# EAGLE design Controle_16_reles V4 (EAGLE 4.09)
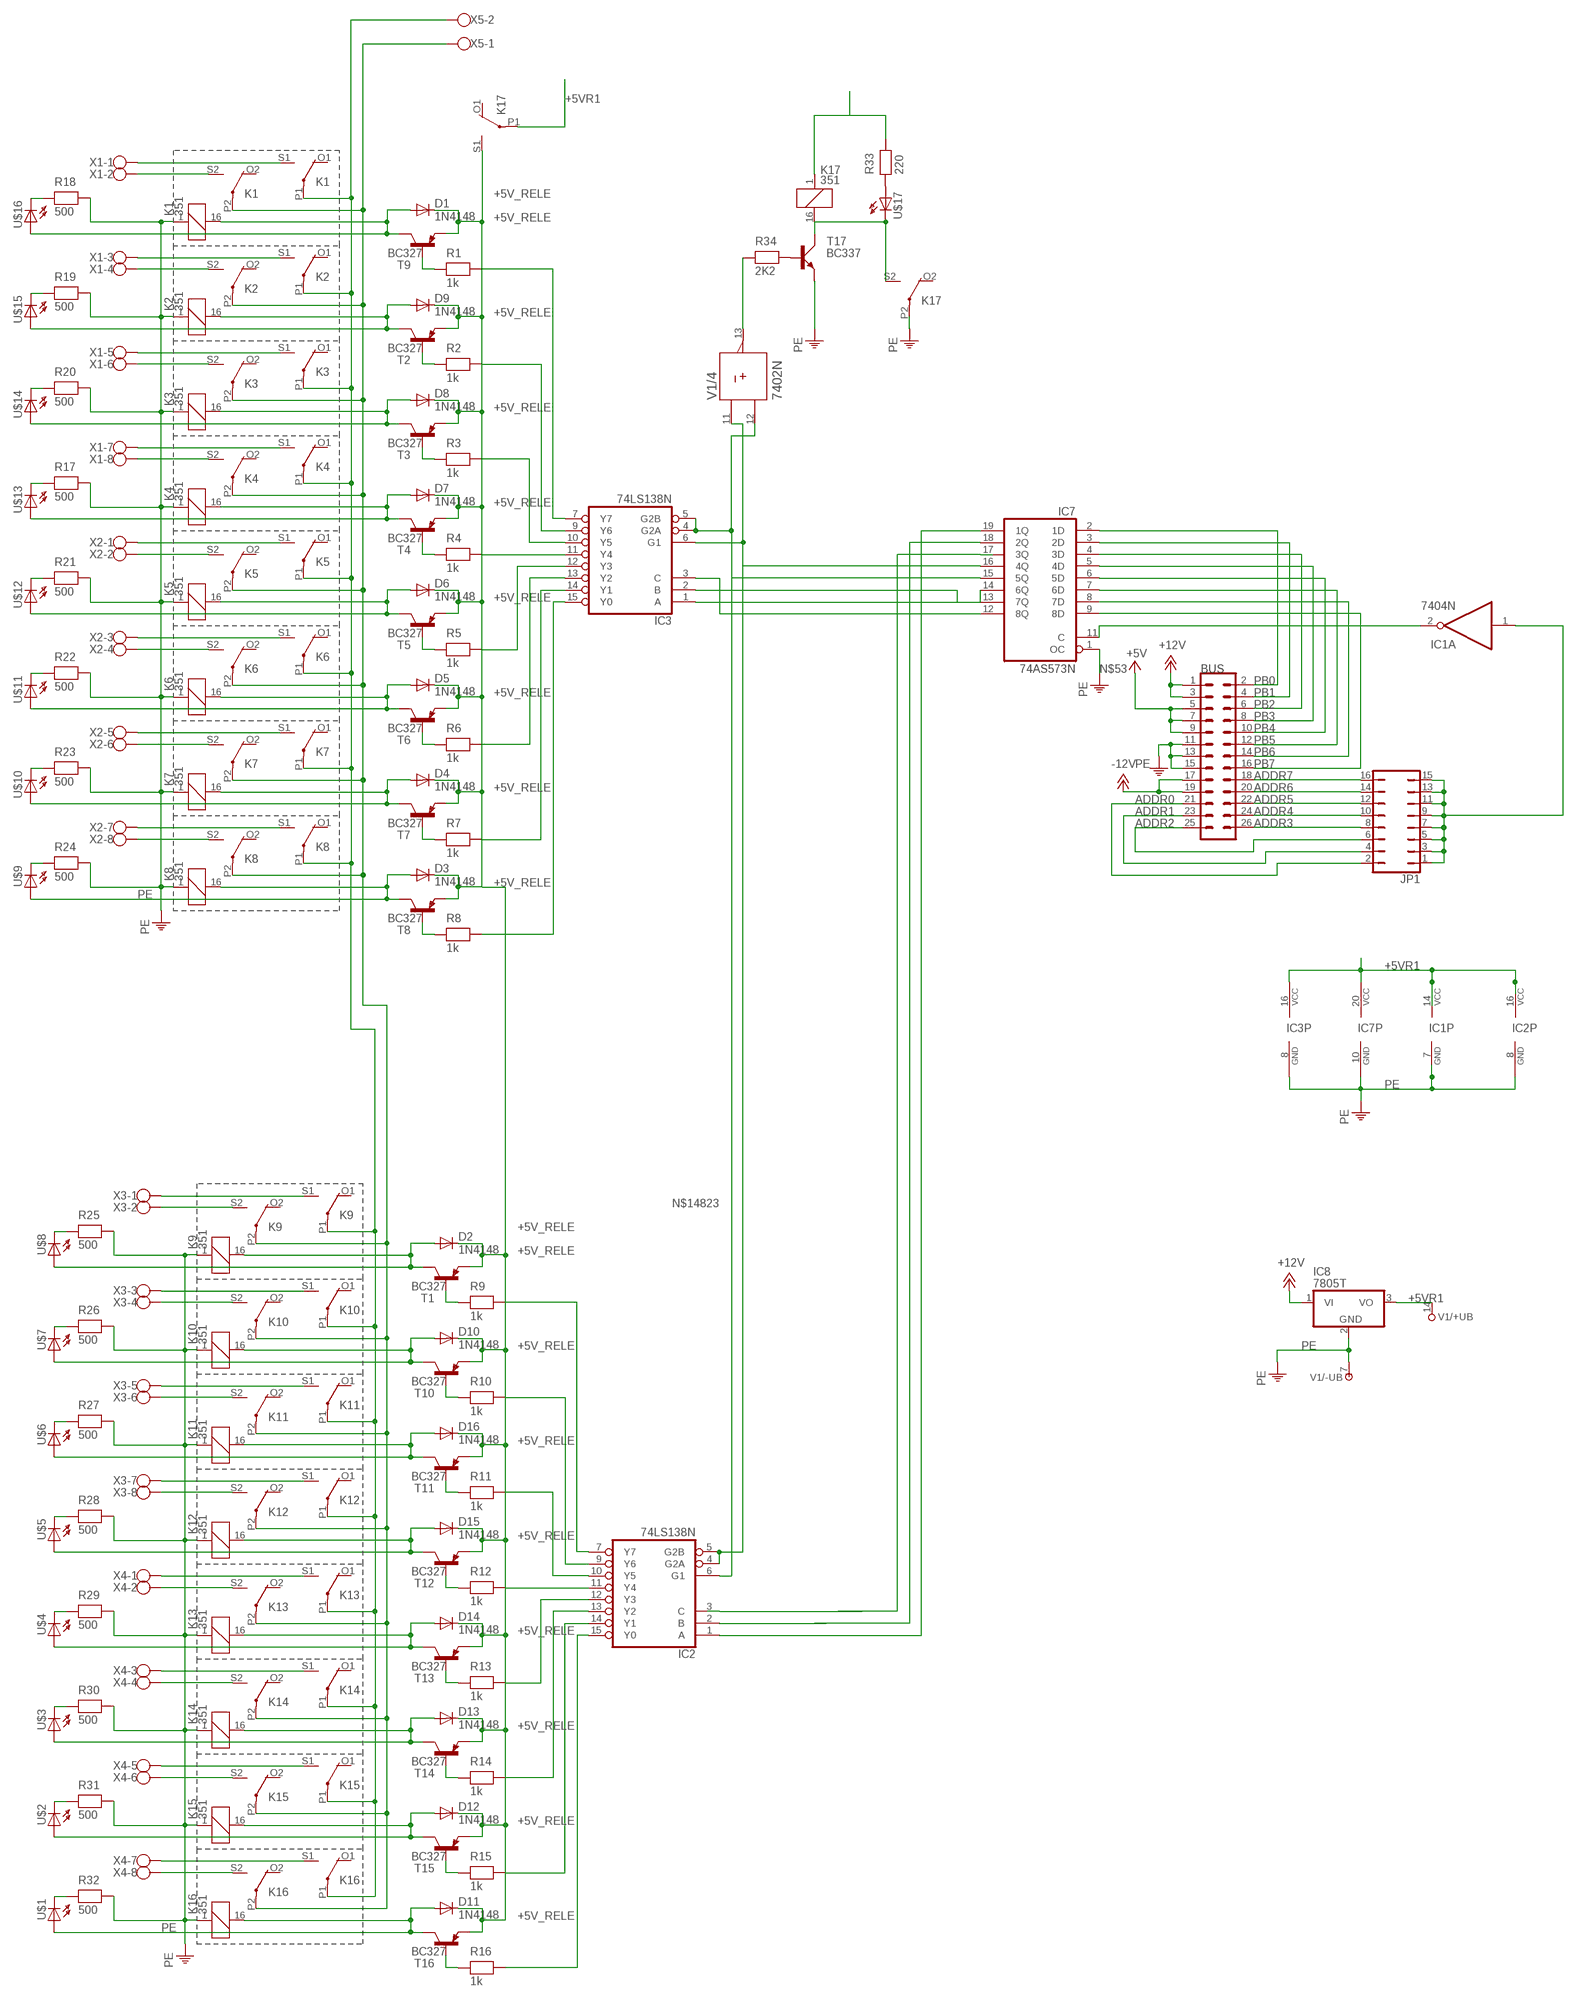
[diagram p0: schematic, sheet 1]

## Parts
BUS  ML26  [ML26]
D1  1N4148  [DO35-10]
D2  1N4148  [DO35-10]
D3  1N4148  [DO35-10]
D4  1N4148  [DO35-10]
D5  1N4148  [DO35-10]
D6  1N4148  [DO35-10]
D7  1N4148  [DO35-10]
D8  1N4148  [DO35-10]
D9  1N4148  [DO35-10]
D10  1N4148  [DO35-10]
D11  1N4148  [DO35-10]
D12  1N4148  [DO35-10]
D13  1N4148  [DO35-10]
D14  1N4148  [DO35-10]
D15  1N4148  [DO35-10]
D16  1N4148  [DO35-10]
IC1  7404N  [DIL14]
IC2  74LS138N  [DIL16]
IC3  74LS138N  [DIL16]
IC7  74AS573N  [DIL20]
IC8  7805T  [TO220H]
JP1  JP8Q  [JP8Q]
K1  351  [351]
K2  351  [351]
K3  351  [351]
K4  351  [351]
K5  351  [351]
K6  351  [351]
K7  351  [351]
K8  351  [351]
K9  351  [351]
K10  351  [351]
K11  351  [351]
K12  351  [351]
K13  351  [351]
K14  351  [351]
K15  351  [351]
K16  351  [351]
K17  351  [351]
R1  1k  RESEU-10  [R-10]
R2  1k  RESEU-10  [R-10]
R3  1k  RESEU-10  [R-10]
R4  1k  RESEU-10  [R-10]
R5  1k  RESEU-10  [R-10]
R6  1k  RESEU-10  [R-10]
R7  1k  RESEU-10  [R-10]
R8  1k  RESEU-10  [R-10]
R9  1k  RESEU-10  [R-10]
R10  1k  RESEU-10  [R-10]
R11  1k  RESEU-10  [R-10]
R12  1k  RESEU-10  [R-10]
R13  1k  RESEU-10  [R-10]
R14  1k  RESEU-10  [R-10]
R15  1k  RESEU-10  [R-10]
R16  1k  RESEU-10  [R-10]
R17  500  RESEU-10  [R-10]
R18  500  RESEU-10  [R-10]
R19  500  RESEU-10  [R-10]
R20  500  RESEU-10  [R-10]
R21  500  RESEU-10  [R-10]
R22  500  RESEU-10  [R-10]
R23  500  RESEU-10  [R-10]
R24  500  RESEU-10  [R-10]
R25  500  RESEU-10  [R-10]
R26  500  RESEU-10  [R-10]
R27  500  RESEU-10  [R-10]
R28  500  RESEU-10  [R-10]
R29  500  RESEU-10  [R-10]
R30  500  RESEU-10  [R-10]
R31  500  RESEU-10  [R-10]
R32  500  RESEU-10  [R-10]
R33  220  RESEU-10  [R-10]
R34  2K2  RESEU-10  [R-10]
T1  BC327  [TO92]
T2  BC327  [TO92]
T3  BC327  [TO92]
T4  BC327  [TO92]
T5  BC327  [TO92]
T6  BC327  [TO92]
T7  BC327  [TO92]
T8  BC327  [TO92]
T9  BC327  [TO92]
T10  BC327  [TO92]
T11  BC327  [TO92]
T12  BC327  [TO92]
T13  BC327  [TO92]
T14  BC327  [TO92]
T15  BC327  [TO92]
T16  BC327  [TO92]
T17  BC337  [SOT54A]
U$1  LED3MM  [LED3MM]
U$2  LED3MM  [LED3MM]
U$3  LED3MM  [LED3MM]
U$4  LED3MM  [LED3MM]
U$5  LED3MM  [LED3MM]
U$6  LED3MM  [LED3MM]
U$7  LED3MM  [LED3MM]
U$8  LED3MM  [LED3MM]
U$9  LED3MM  [LED3MM]
U$10  LED3MM  [LED3MM]
U$11  LED3MM  [LED3MM]
U$12  LED3MM  [LED3MM]
U$13  LED3MM  [LED3MM]
U$14  LED3MM  [LED3MM]
U$15  LED3MM  [LED3MM]
U$16  LED3MM  [LED3MM]
U$17  LED3MM  [LED3MM]
V1  7402N  [DIL14]
X1  AK500/8  [AK500/8]
X2  AK500/8  [AK500/8]
X3  AK500/8  [AK500/8]
X4  AK500/8  [AK500/8]
X5  AK300/2  [AK300/2]

## Nets
+5V: BUS.5 BUS.7 BUS.9
+5V_RELE: D1.C D2.C D3.C D4.C D5.C D6.C D7.C D8.C D9.C D10.C D11.C D12.C D13.C D14.C D15.C D16.C K17.S1(2:S) T1.1(E) T2.1(E) T3.1(E) T4.1(E) T5.1(E) T6.1(E) T7.1(E) T8.1(E) T9.1(E) T10.1(E) T11.1(E) T12.1(E) T13.1(E) T14.1(E) T15.1(E) T16.1(E)
+5VR1: IC1.14(P:VCC) IC2.16(VCC) IC3.16(VCC) IC7.20(VCC) IC8.3(VO) K17.1 K17.P1(2:P) R33.2 V1.14(/+UB:+UB)
+12V: BUS.1 BUS.3 IC8.1(VI)
-12V: BUS.17 BUS.19
ADDR0: BUS.21 JP1.2
ADDR1: BUS.23 JP1.4
ADDR2: BUS.25 JP1.6
ADDR3: BUS.26 JP1.8
ADDR4: BUS.24 JP1.10
ADDR5: BUS.22 JP1.12
ADDR6: BUS.20 JP1.14
ADDR7: BUS.18 JP1.16
GARANTIA1: IC2.6(G1) IC3.4(G2A) IC3.5(G2B) IC7.15(5Q) V1.12(/4:B)
GARANTIA2: IC2.4(G2A) IC2.5(G2B) IC3.6(G1) IC7.16(4Q) V1.11(/4:A)
N$1: R9.1 T1.2(B)
N$2: R5.1 T5.2(B)
N$3: IC3.7(Y7) R1.2
N$4: IC3.9(Y6) R2.2
N$5: IC3.10(Y5) R3.2
N$6: IC3.11(Y4) R4.2
N$7: IC3.15(Y0) R8.2
N$8: IC3.14(Y1) R7.2
N$9: IC3.13(Y2) R6.2
N$10: R1.1 T9.2(B)
N$12: IC2.2(B) IC7.18(2Q)
N$13: R34.2 T17.B
N$15: D6.A K5.16 T5.3(C) U$12.A
N$16: K17.16 K17.S2(3:S) T17.C U$17.K(C)
N$17: R2.1 T2.2(B)
N$18: D1.A K1.16 T9.3(C) U$16.A
N$19: D9.A K2.16 T2.3(C) U$15.A
N$20: R6.1 T6.2(B)
N$21: R3.1 T3.2(B)
N$22: D8.A K3.16 T3.3(C) U$14.A
N$23: D5.A K6.16 T6.3(C) U$11.A
N$24: R4.1 T4.2(B)
N$25: D7.A K4.16 T4.3(C) U$13.A
N$26: R7.1 T7.2(B)
N$27: D4.A K7.16 T7.3(C) U$10.A
N$28: R8.1 T8.2(B)
N$29: D3.A K8.16 T8.3(C) U$9.A
N$30: IC3.12(Y3) R5.2
N$32: R34.1 V1.13(/4:Y)
N$33: IC1.1(A:I) JP1.1 JP1.3 JP1.5 JP1.7 JP1.9 JP1.11 JP1.13 JP1.15
N$34: IC3.1(A) IC7.14(6Q)
N$35: K1.S1(2:S) X1.1
N$36: K1.S2(3:S) X1.2
N$37: K2.S1(2:S) X1.3
N$38: K2.S2(3:S) X1.4
N$39: K3.S1(2:S) X1.5
N$40: K3.S2(3:S) X1.6
N$41: K4.S1(2:S) X1.7
N$42: K4.S2(3:S) X1.8
N$43: K5.S1(2:S) X2.1
N$44: K5.S2(3:S) X2.2
N$45: K6.S1(2:S) X2.3
N$46: K6.S2(3:S) X2.4
N$47: K7.S1(2:S) X2.5
N$48: K7.S2(3:S) X2.6
N$49: K8.S1(2:S) X2.7
N$50: K8.S2(3:S) X2.8
N$51: R18.1 U$16.K(C)
N$52: D2.A K9.16 T1.3(C) U$8.A
N$53: IC1.2(A:O) IC7.11(C)
N$54: R10.1 T10.2(B)
N$55: D10.A K10.16 T10.3(C) U$7.A
N$56: R11.1 T11.2(B)
N$57: D16.A K11.16 T11.3(C) U$6.A
N$58: R12.1 T12.2(B)
N$60: D15.A K12.16 T12.3(C) U$5.A
N$61: R13.1 T13.2(B)
N$62: D14.A K13.16 T13.3(C) U$4.A
N$63: R14.1 T14.2(B)
N$64: D13.A K14.16 T14.3(C) U$3.A
N$65: R15.1 T15.2(B)
N$66: D12.A K15.16 T15.3(C) U$2.A
N$67: R16.1 T16.2(B)
N$68: D11.A K16.16 T16.3(C) U$1.A
N$69: IC2.7(Y7) R9.2
N$70: IC2.9(Y6) R10.2
N$71: IC2.10(Y5) R11.2
N$72: IC2.11(Y4) R12.2
N$73: IC2.15(Y0) R16.2
N$74: IC2.14(Y1) R15.2
N$75: IC2.13(Y2) R14.2
N$76: IC2.12(Y3) R13.2
N$77: IC3.2(B) IC7.13(7Q)
N$78: K9.S1(2:S) X3.1
N$79: K9.S2(3:S) X3.2
N$80: K10.S1(2:S) X3.3
N$81: K10.S2(3:S) X3.4
N$82: K11.S1(2:S) X3.5
N$83: K11.S2(3:S) X3.6
N$84: K12.S1(2:S) X3.7
N$85: K12.S2(3:S) X3.8
N$86: K13.S1(2:S) X4.1
N$87: K13.S2(3:S) X4.2
N$88: K14.S1(2:S) X4.3
N$89: K14.S2(3:S) X4.4
N$90: K15.S1(2:S) X4.5
N$91: K15.S2(3:S) X4.6
N$92: K16.S1(2:S) X4.7
N$93: K16.S2(3:S) X4.8
N$94: R20.1 U$14.K(C)
N$95: R19.1 U$15.K(C)
N$96: R32.1 U$1.K(C)
N$97: IC3.3(C) IC7.12(8Q)
N$98: R17.1 U$13.K(C)
N$112: R33.1 U$17.A
N$114: IC2.3(C) IC7.17(3Q)
N$118: IC2.1(A) IC7.19(1Q)
N$148: K1.P1(2:P) K2.P1(2:P) K3.P1(2:P) K4.P1(2:P) K5.P1(2:P) K6.P1(2:P) K7.P1(2:P) K8.P1(2:P) K9.P1(2:P) K10.P1(2:P) K11.P1(2:P) K12.P1(2:P) K13.P1(2:P) K14.P1(2:P) K15.P1(2:P) K16.P1(2:P) X5.2
N$150: R21.1 U$12.K(C)
N$153: R22.1 U$11.K(C)
N$156: R23.1 U$10.K(C)
N$160: R24.1 U$9.K(C)
N$163: R25.1 U$8.K(C)
N$165: R26.1 U$7.K(C)
N$169: R27.1 U$6.K(C)
N$171: R28.1 U$5.K(C)
N$174: R29.1 U$4.K(C)
N$177: R30.1 U$3.K(C)
N$180: R31.1 U$2.K(C)
N$14823: K1.P2(3:P) K2.P2(3:P) K3.P2(3:P) K4.P2(3:P) K5.P2(3:P) K6.P2(3:P) K7.P2(3:P) K8.P2(3:P) K9.P2(3:P) K10.P2(3:P) K11.P2(3:P) K12.P2(3:P) K13.P2(3:P) K14.P2(3:P) K15.P2(3:P) K16.P2(3:P) X5.1
PB0: BUS.2 IC7.2(1D)
PB1: BUS.4 IC7.3(2D)
PB2: BUS.6 IC7.4(3D)
PB3: BUS.8 IC7.5(4D)
PB4: BUS.10 IC7.6(5D)
PB5: BUS.12 IC7.7(6D)
PB6: BUS.14 IC7.8(7D)
PB7: BUS.16 IC7.9(8D)
PE: BUS.11 BUS.13 BUS.15 IC1.7(P:GND) IC2.8(GND) IC3.8(GND) IC7.1(OC) IC7.10(GND) IC8.2(GND) K1.1 K2.1 K3.1 K4.1 K5.1 K6.1 K7.1 K8.1 K9.1 K10.1 K11.1 K12.1 K13.1 K14.1 K15.1 K16.1 K17.P2(3:P) R17.2 R18.2 R19.2 R20.2 R21.2 R22.2 R23.2 R24.2 R25.2 R26.2 R27.2 R28.2 R29.2 R30.2 R31.2 R32.2 T17.E V1.7(/-UB:-UB)
Unconnected: IC1.3(B:I) IC1.4(B:O) IC1.5(C:I) IC1.6(C:O) IC1.8(D:O) IC1.9(D:I) IC1.10(E:O) IC1.11(E:I) IC1.12(F:O) IC1.13(F:I) K1.O1(2:O) K1.O2(3:O) K2.O1(2:O) K2.O2(3:O) K3.O1(2:O) K3.O2(3:O) K4.O1(2:O) K4.O2(3:O) K5.O1(2:O) K5.O2(3:O) K6.O1(2:O) K6.O2(3:O) K7.O1(2:O) K7.O2(3:O) K8.O1(2:O) K8.O2(3:O) K9.O1(2:O) K9.O2(3:O) K10.O1(2:O) K10.O2(3:O) K11.O1(2:O) K11.O2(3:O) K12.O1(2:O) K12.O2(3:O) K13.O1(2:O) K13.O2(3:O) K14.O1(2:O) K14.O2(3:O) K15.O1(2:O) K15.O2(3:O) K16.O1(2:O) K16.O2(3:O) K17.O1(2:O) K17.O2(3:O) V1.1(/1:Y) V1.2(/1:A) V1.3(/1:B) V1.4(/2:Y) V1.5(/2:A) V1.6(/2:B) V1.8(/3:A) V1.9(/3:B) V1.10(/3:Y)

## Library data of the parts
BUS = con-harting-ml:ML26: HARTING
D1-D16 = diode:1N4148: DIODE high speed (Philips)
IC1 = 74xx-us:74*04: Hex INVERTER
IC2 IC3 = 74xx-us:74*138: 3-line to 8-line DECODER/DEMULTIPLEXER
IC7 = 74xx-us:74*573: 8-bit D latch BUS DRIVER
IC8 = linear:78*: Positive VOLTAGE REGULATOR
JP1 = jumper:JP8Q: JUMPER
K1-K17 = relay:351: RELAY 2 x switch, Omron
R1-R34 = discrete:RESEU-10
T1-T16 = transistor-pnp:BC327: PNP Transistor
T17 = transistor-small-signal:BC337: NPN TRANSISTOR
U$1-U$17 = led:LED: LED
V1 = 74ttl-din:74*02: Quad 2-input NOR gate
X1-X4 = con-ptr500:AK500/8: CONNECTOR
X5 = con-ptr500:AK300/2: CONNECTOR

## Board
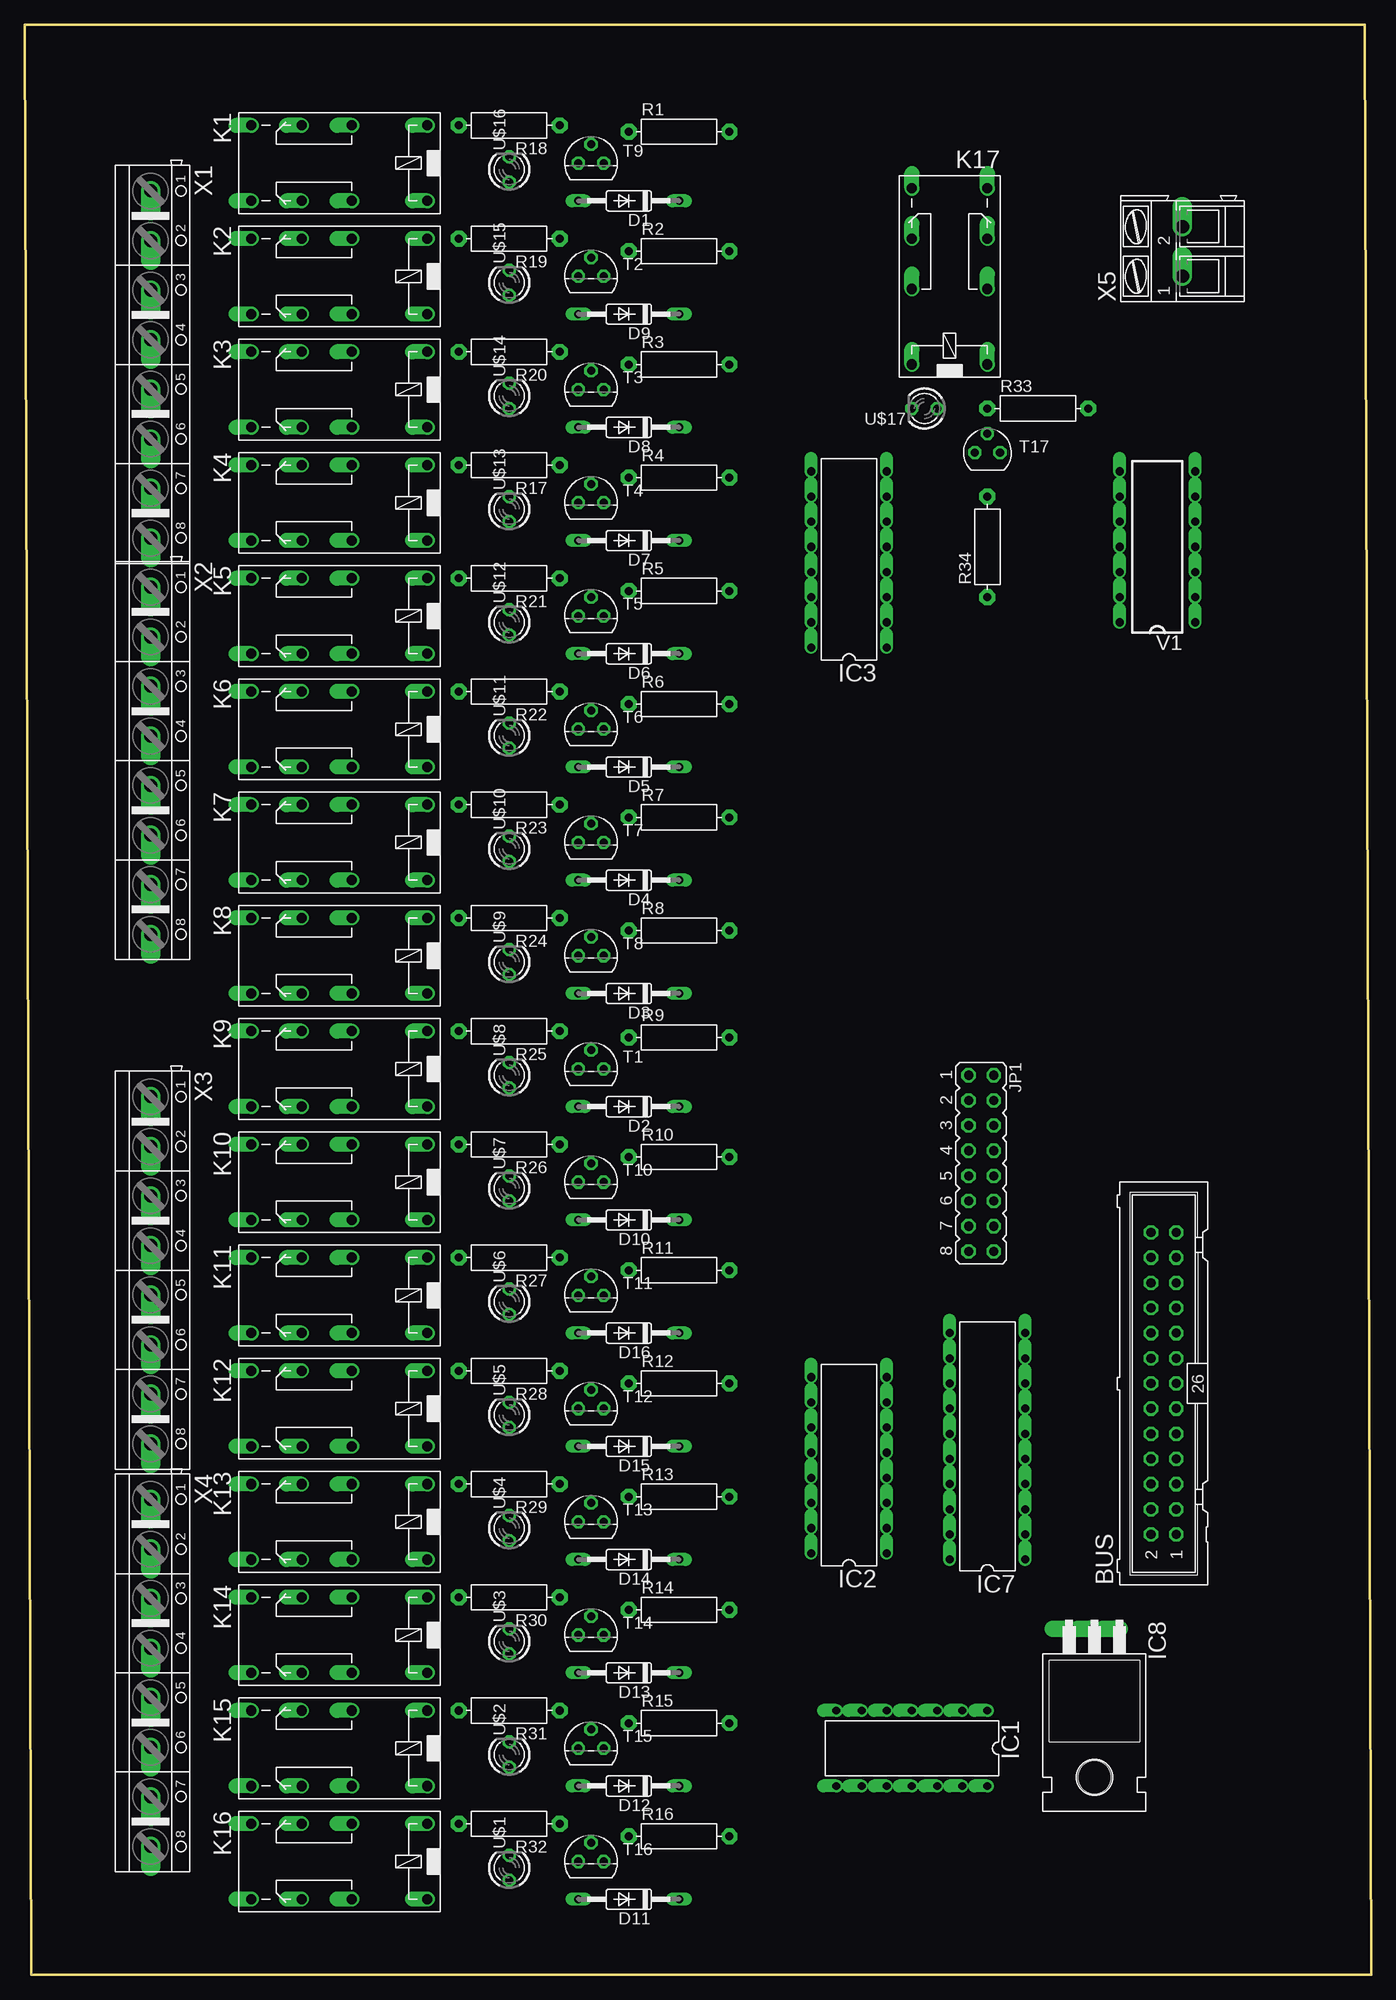
[diagram p1: board, top side]
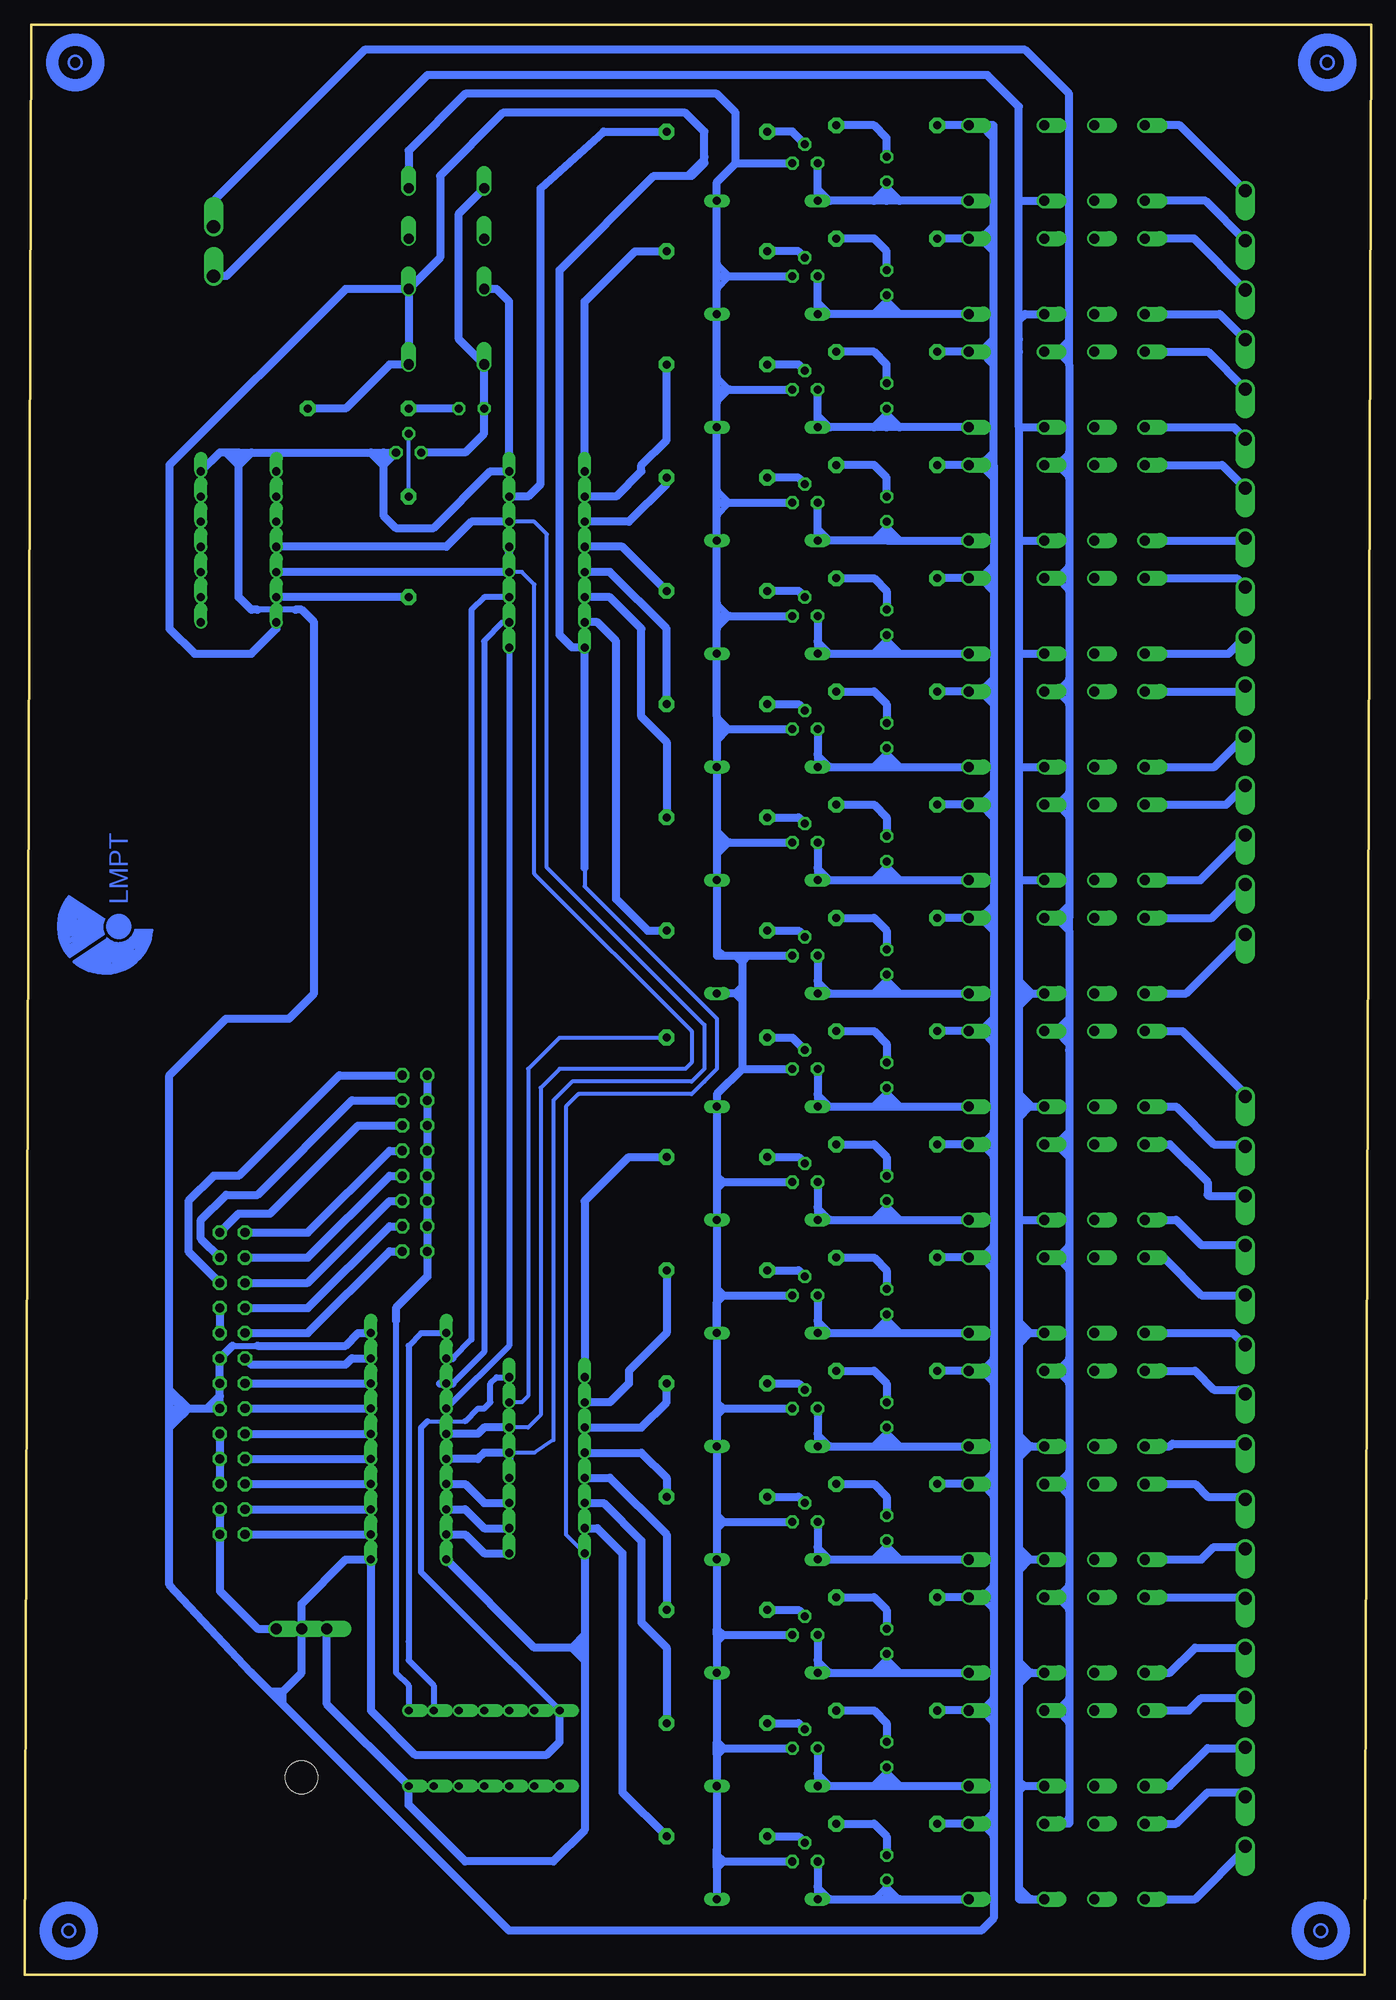
[diagram p2: board, bottom side, seen from below]

Size 135.89 x 196.85 mm. Coordinates in mm from the lower left corner, seen from the top.
Outline: 135.25,196.85 135.89,0 0.64,0 0,196.85 135.25,196.85
Copper layers used: Bottom

### Footprints (pad centres in the part's own frame; a part is rotated, then mirrored left to right if it is on the bottom)
ML26 = drill 0.914 octagon: 1 -15.24,-1.27; 2 -15.24,1.27; 3 -12.7,-1.27; 4 -12.7,1.27; 5 -10.16,-1.27; 6 -10.16,1.27; 7 -7.62,-1.27; 8 -7.62,1.27; 9 -5.08,-1.27; 10 -5.08,1.27; 11 -2.54,-1.27; 12 -2.54,1.27; 13 0,-1.27; 14 0,1.27; 15 2.54,-1.27; 16 2.54,1.27; 17 5.08,-1.27; 18 5.08,1.27; 19 7.62,-1.27; 20 7.62,1.27; 21 10.16,-1.27; 22 10.16,1.27; 23 12.7,-1.27; 24 12.7,1.27; 25 15.24,-1.27; 26 15.24,1.27
DO35-10 = drill 0.813 long: A 5.08,0; C -5.08,0
DIL14 = drill 0.8 offset: 1 -7.62,-3.81; 2 -5.08,-3.81; 3 -2.54,-3.81; 4 0,-3.81; 5 2.54,-3.81; 6 5.08,-3.81; 7 7.62,-3.81; 8 7.62,3.81; 9 5.08,3.81; 10 2.54,3.81; 11 0,3.81; 12 -2.54,3.81; 13 -5.08,3.81; 14 -7.62,3.81
DIL16 = drill 0.813 offset: 1 -8.89,-3.81; 2 -6.35,-3.81; 3 -3.81,-3.81; 4 -1.27,-3.81; 5 1.27,-3.81; 6 3.81,-3.81; 7 6.35,-3.81; 8 8.89,-3.81; 9 8.89,3.81; 10 6.35,3.81; 11 3.81,3.81; 12 1.27,3.81; 13 -1.27,3.81; 14 -3.81,3.81; 15 -6.35,3.81; 16 -8.89,3.81
DIL20 = drill 0.813 offset: 1 -11.43,-3.81; 2 -8.89,-3.81; 3 -6.35,-3.81; 4 -3.81,-3.81; 5 -1.27,-3.81; 6 1.27,-3.81; 7 3.81,-3.81; 8 6.35,-3.81; 9 8.89,-3.81; 10 11.43,-3.81; 11 11.43,3.81; 12 8.89,3.81; 13 6.35,3.81; 14 3.81,3.81; 15 1.27,3.81; 16 -1.27,3.81; 17 -3.81,3.81; 18 -6.35,3.81; 19 -8.89,3.81; 20 -11.43,3.81
TO220H = drill 1.118 offset: 1 -2.54,-10.16; 2 0,-10.16; 3 2.54,-10.16 | hole 3.302: 0,4.826
JP8Q = drill 0.914 octagon: 1 -8.89,-1.27; 2 -8.89,1.27; 3 -6.35,-1.27; 4 -6.35,1.27; 5 -3.81,-1.27; 6 -3.81,1.27; 7 -1.27,-1.27; 8 -1.27,1.27; 9 1.27,-1.27; 10 1.27,1.27; 11 3.81,-1.27; 12 3.81,1.27; 13 6.35,-1.27; 14 6.35,1.27; 15 8.89,-1.27; 16 8.89,1.27
351 = drill 1.016 offset: 1 -3.81,-3.81; 16 -3.81,3.81; O1 8.89,-3.81; O2 8.89,3.81; P1 3.81,-3.81; P2 3.81,3.81; S1 13.97,-3.81; S2 13.97,3.81
R-10 = drill 0.813 pad 1.6 octagon: 1 -5.08,0; 2 5.08,0
TO92 = drill 0.813 octagon: 1 1.27,0; 2 0,1.905; 3 -1.27,0
SOT54A = drill 0.813 octagon: B 0,1.905; C -1.27,0; E 1.27,0
LED3MM = drill 0.813 octagon: A -1.27,0; K 1.27,0
DIL14' = drill 0.813 offset: 1 -7.62,-3.81; 2 -5.08,-3.81; 3 -2.54,-3.81; 4 0,-3.81; 5 2.54,-3.81; 6 5.08,-3.81; 7 7.62,-3.81; 8 7.62,3.81; 9 5.08,3.81; 10 2.54,3.81; 11 0,3.81; 12 -2.54,3.81; 13 -5.08,3.81; 14 -7.62,3.81
AK500/8 = drill 1.321 offset: 1 -17.526,0; 2 -12.497,0; 3 -7.518,0; 4 -2.489,0; 5 2.489,0; 6 7.518,0; 7 12.497,0; 8 17.526,0
AK300/2 = drill 1.321 offset: 1 -2.515,0; 2 2.489,0

### Placement (x,y rotation side)
BUS  114.94,59.69 90 top
D1  60.96,179.07 180 top
D2  60.96,87.63 180 top
D3  60.96,99.06 180 top
D4  60.96,110.49 180 top
D5  60.96,121.92 180 top
D6  60.96,133.35 180 top
D7  60.96,144.78 180 top
D8  60.96,156.21 180 top
D9  60.96,167.64 180 top
D10  60.96,76.2 180 top
D11  60.96,7.62 180 top
D12  60.96,19.05 180 top
D13  60.96,30.48 180 top
D14  60.96,41.91 180 top
D15  60.96,53.34 180 top
D16  60.96,64.77 180 top
IC1  89.54,22.86 180 top
IC2  83.19,51.44 90 top
IC3  83.19,142.88 90 top
IC7  97.16,53.34 90 top
IC8  107.95,24.77 180 top
JP1  96.52,81.91 270 top
K1  36.83,182.88 180 top
K2  36.83,171.45 180 top
K3  36.83,160.02 180 top
K4  36.83,148.59 180 top
K5  36.83,137.16 180 top
K6  36.83,125.73 180 top
K7  36.83,114.3 180 top
K8  36.83,102.87 180 top
K9  36.83,91.44 180 top
K10  36.83,80.01 180 top
K11  36.83,68.58 180 top
K12  36.83,57.15 180 top
K13  36.83,45.72 180 top
K14  36.83,34.29 180 top
K15  36.83,22.86 180 top
K16  36.83,11.43 180 top
K17  93.34,166.37 90 top
R1  66.04,186.06 0 top
R2  66.04,173.99 0 top
R3  66.04,162.56 0 top
R4  66.04,151.13 0 top
R5  66.04,139.7 0 top
R6  66.04,128.27 0 top
R7  66.04,116.84 0 top
R8  66.04,105.41 0 top
R9  66.04,94.61 0 top
R10  66.04,82.55 0 top
R11  66.04,71.12 0 top
R12  66.04,59.69 0 top
R13  66.04,48.26 0 top
R14  66.04,36.83 0 top
R15  66.04,25.4 0 top
R16  66.04,13.97 0 top
R17  48.9,152.4 180 top
R18  48.9,186.69 180 top
R19  48.9,175.26 180 top
R20  48.9,163.83 180 top
R21  48.9,140.97 180 top
R22  48.9,129.54 180 top
R23  48.9,118.11 180 top
R24  48.9,106.68 180 top
R25  48.9,95.25 180 top
R26  48.9,83.82 180 top
R27  48.9,72.39 180 top
R28  48.9,60.96 180 top
R29  48.9,49.53 180 top
R30  48.9,38.1 180 top
R31  48.9,26.67 180 top
R32  48.9,15.24 180 top
R33  102.24,158.12 0 top
R34  97.16,144.15 90 top
T1  57.15,91.44 0 top
T2  57.15,171.45 0 top
T3  57.15,160.02 0 top
T4  57.15,148.59 0 top
T5  57.15,137.16 0 top
T6  57.15,125.73 0 top
T7  57.15,114.3 0 top
T8  57.15,102.87 0 top
T9  57.15,182.88 0 top
T10  57.15,80.01 0 top
T11  57.15,68.58 0 top
T12  57.15,57.15 0 top
T13  57.15,45.72 0 top
T14  57.15,34.29 0 top
T15  57.15,22.86 0 top
T16  57.15,11.43 0 top
T17  97.16,153.67 0 top
U$1  48.9,10.8 90 top
U$2  48.9,22.22 90 top
U$3  48.9,33.66 90 top
U$4  48.9,45.08 90 top
U$5  48.9,56.52 90 top
U$6  48.9,67.94 90 top
U$7  48.9,79.38 90 top
U$8  48.9,90.81 90 top
U$9  48.9,102.23 90 top
U$10  48.9,113.67 90 top
U$11  48.9,125.09 90 top
U$12  48.9,136.53 90 top
U$13  48.9,147.95 90 top
U$14  48.9,159.38 90 top
U$15  48.9,170.81 90 top
U$16  48.9,182.25 90 top
U$17  90.81,158.12 180 top
V1  7402N  [DIL14']  114.3,144.15 90 top
X1  12.7,162.56 270 top
X2  12.7,122.56 270 top
X3  12.7,71.12 270 top
X4  12.7,30.48 270 top
X5  116.84,173.99 90 top

### Tracks (layer width: path | path; a pad name or v marks a point on that pad's centre or on a via)
+5V
  Bottom 0.813: BUS.5 BUS.7 BUS.9
+5V_RELE
  Bottom 0.61: 66.04,124.46 64.77,125.73 66.04,127 | 66.04,138.43 64.77,137.16 66.04,135.89 | 66.04,149.86 64.77,148.59 66.04,147.32 | 66.04,161.29 64.77,160.02 66.04,158.75 | 66.04,172.72 64.77,171.45 66.04,170.18 | 66.04,115.57 64.77,114.3 66.04,113.03
  Bottom 0.813: D4.C 66.04,113.03 66.04,114.3 | 66.04,114.3 64.77,114.3 T7.1 66.04,114.3 | 66.04,125.73 66.04,124.46 D5.C 66.04,115.57 66.04,114.3 | 66.04,125.73 64.77,125.73 T6.1 | 66.04,137.16 66.04,135.89 D6.C 66.04,127 66.04,125.73 | 66.04,137.16 64.77,137.16 T5.1 | 66.04,148.59 66.04,147.32 D7.C 66.04,138.43 66.04,137.16 | 66.04,148.59 64.77,148.59 T4.1 | 66.04,160.02 66.04,158.75 D8.C 66.04,149.86 66.04,148.59 | 66.04,160.02 64.77,160.02 T3.1 | 66.04,171.45 66.04,170.18 D9.C 66.04,161.29 66.04,160.02 | 66.04,171.45 64.77,171.45 T2.1 | 66.04,171.45 66.04,172.72 D1.C 66.04,180.97 64.14,182.88 | 66.04,114.3 D4.C | D4.C 66.04,104.14 | 66.04,102.87 64.14,102.87 | 66.04,80.64 D2.C 66.04,88.9 63.5,91.44 | 66.04,80.01 66.04,79.38 | 63.5,102.87 62.87,102.87 | 62.87,102.87 T8.1 | 66.04,102.87 65.41,102.87 | 66.04,104.14 66.04,102.87 | 66.04,104.14 66.04,103.5 65.41,102.87 | 65.41,102.87 64.14,102.87 | 64.14,102.87 63.5,102.87 | 63.5,102.87 63.5,102.23 | 63.5,102.23 63.5,99.69 | 63.5,99.69 63.5,99.06 | 63.5,99.06 63.5,98.42 | 63.5,98.42 63.5,91.44 | 63.5,91.44 T1.1 | 65.41,80.01 T10.1 | 66.04,80.01 65.41,80.01 | 66.04,80.64 66.04,80.01 | 66.04,80.64 65.41,80.01 | 65.41,80.01 66.04,79.38 | 66.04,79.38 D10.C 66.04,69.22 | 66.04,69.22 66.04,68.58 | 66.04,68.58 65.41,68.58 | 65.41,68.58 T11.1 | D16.C 66.04,67.31 | 66.04,68.58 66.04,67.31 | 66.04,67.31 66.04,67.94 65.41,68.58 | 66.04,69.22 65.41,68.58 | 66.04,69.22 D16.C | D16.C 66.04,58.42 | 66.04,58.42 66.04,57.15 | 66.04,56.52 D15.C 66.04,46.36 | 66.04,46.36 66.04,45.72 | 66.04,44.45 D14.C 66.04,34.92 | 66.04,33.66 D13.C 66.04,23.5 | 66.04,22.22 D12.C 66.04,12.7 | 66.04,10.8 D11.C | 66.04,10.8 66.04,11.43
  Bottom 0.813: 65.41,11.43 T16.1 | 66.04,11.43 65.41,11.43 | 66.04,11.43 66.04,12.7 | 66.04,12.7 66.04,12.06 65.41,11.43 | 66.04,10.8 65.41,11.43 | 66.04,22.22 66.04,10.8 | 66.04,22.22 66.04,22.86 | 65.41,22.86 T15.1 | 66.04,22.86 65.41,22.86 | 66.04,22.86 66.04,23.5 | 65.41,22.86 66.04,23.5 | 66.04,22.22 65.41,22.86 | 66.04,33.66 66.04,22.22 | 65.41,34.29 T14.1 | 66.04,34.92 65.41,34.29 | 66.04,34.29 66.04,34.92 | 66.04,34.29 66.04,33.66 | 66.04,33.66 65.41,34.29 | 66.04,34.29 65.41,34.29 | 66.04,44.45 66.04,34.29 | 65.41,45.72 T13.1 | 66.04,45.72 65.41,45.72 | 66.04,45.72 66.04,44.45 | 66.04,44.45 66.04,45.08 65.41,45.72 | 66.04,46.36 65.41,45.72 | 66.04,56.52 66.04,46.36 | 66.04,57.15 66.04,56.52 | 66.04,57.15 65.41,57.15 | 65.41,57.15 T12.1 | 66.04,56.52 65.41,57.15 | 66.04,58.42 66.04,56.52 | 66.04,58.42 66.04,57.78 65.41,57.15 | 64.14,182.88 T9.1 | 64.14,182.88 64.14,187.96 66.04,189.87 91.44,189.87 97.16,184.15 97.16,180.97 K17.S1 | 64.14,99.06 D3.C | 63.5,99.06 64.14,99.06 | 63.5,99.69 64.14,99.06 | 63.5,99.69 63.5,98.42 | 64.14,99.06 63.5,98.42 | 63.5,102.23 62.87,102.87 | 64.14,102.87 63.5,102.23
+5VR1
  Bottom 0.406: IC2.16 81.28,44.45 81.28,87.63 80.01,88.9 68.58,88.9 | 68.58,88.9 67.31,90.17 | 68.58,88.9 66.04,91.44 66.04,96.52 79.38,109.86 79.38,111.76 | 72.39,181.61 69.22,181.61 67.31,183.51
  Bottom 0.813: IC7.20 84.46,33.02 80.65,33.02 | 79.38,33.02 80.65,33.02 | 79.38,34.29 79.38,33.02 | IC2.16 79.38,34.29 | 79.38,33.02 79.38,31.75 | IC8.3 105.41,27.31 IC1.14 97.16,17.14 91.44,11.43 82.55,11.43 79.38,14.61 79.38,31.75 | 79.38,34.29 80.65,33.02 | 80.65,33.02 79.38,31.75 | V1.14 110.49,135.89 113.03,133.35 118.75,133.35 121.28,135.89 121.28,152.4 103.51,170.18 K17.P1 | K17.P1 93.98,173.35 93.98,181.61 87.63,187.96 69.22,187.96 67.31,186.06 67.31,183.51 67.31,182.88 68.58,181.61 72.39,181.61 81.92,172.09 81.92,135.25 80.65,133.99 IC3.16 79.38,111.76 | R33.2 103.51,158.12 99.06,162.56 K17.1 K17.P1
+12V
  Bottom 0.813: BUS.3 BUS.1 116.21,38.73 112.4,34.92 IC8.1
-12V
  Bottom 0.813: BUS.19 BUS.17
ADDR0
  Bottom 0.813: BUS.21 119.38,73.03 119.38,78.1 116.84,80.64 114.3,80.64 104.14,90.81 JP1.2
ADDR1
  Bottom 0.813: JP1.4 102.87,88.27 112.4,78.74 115.57,78.74 118.11,76.2 118.11,74.3 BUS.23
ADDR2
  Bottom 0.813: JP1.6 102.24,85.72 111.12,76.84 114.3,76.84 BUS.25
ADDR3
  Bottom 0.813: 112.4,74.93 BUS.26 107.31,74.93 99.06,83.19 JP1.8
ADDR4
  Bottom 0.813: 112.4,72.39 BUS.24 107.31,72.39 99.06,80.64 JP1.10
ADDR5
  Bottom 0.813: JP1.12 99.06,78.1 107.31,69.85 BUS.22
ADDR6
  Bottom 0.813: JP1.14 99.06,75.56 107.31,67.31 BUS.20
ADDR7
  Bottom 0.813: JP1.16 99.06,73.03 107.31,64.77 BUS.18
GARANTIA1
  Bottom 0.406: IC3.4 85.73,141.6 84.46,140.34 84.46,111.12 68.58,95.25 68.58,92.08 69.22,91.44 81.92,91.44 83.82,89.53 83.82,56.52 85.09,55.24 IC2.6
  Bottom 0.813: V1.12 IC3.4 IC3.5 | IC2.6 89.54,55.24 90.17,54.61 IC7.15
GARANTIA2
  Bottom 0.406: IC3.6 84.46,146.69 83.19,145.41 83.19,111.76 67.31,95.89 67.31,91.44 68.58,90.17 80.65,90.17 82.55,88.27 82.55,53.98 84.46,52.7 IC2.5
  Bottom 0.813: IC3.6 90.81,146.69 93.34,144.15 V1.11 | IC2.4 IC2.5 89.54,52.7 90.17,52.07 IC7.16
N$1
  Bottom 0.813: T1.2 58.42,94.61 R9.1
N$2
  Bottom 0.813: R5.1 57.79,139.7 T5.2
N$3
  Bottom 0.813: R1.2 77.47,186.06 83.82,180.34 83.82,150.5 85.09,149.22 IC3.7
N$4
  Bottom 0.813: R2.2 74.3,173.99 79.38,168.91 IC3.9
N$5
  Bottom 0.813: IC3.10 76.2,149.22 73.66,151.76 73.66,152.4 71.12,154.94 R3.2
N$6
  Bottom 0.813: R4.2 71.12,150.5 74.93,146.69 IC3.11
N$7
  Bottom 0.813: IC3.15 78.11,136.53 76.2,134.62 76.2,108.58 73.03,105.41 R8.2
N$8
  Bottom 0.813: R7.2 71.12,124.46 73.66,127 73.66,135.89 76.84,139.06 IC3.14
N$9
  Bottom 0.813: R6.2 71.12,135.89 76.84,141.6 IC3.13
N$10
  Bottom 0.813: R1.1 58.42,186.06 T9.2
N$11
  Bottom 0.254: 123.02,105.44 124.75,105.44
N$12
  Bottom 0.813: IC7.18 91.44,46.99 89.54,45.08 IC2.2
N$13
  Bottom 0.406: R34.2 T17.B
N$15
  Bottom 0.61: 55.88,134.62 54.61,133.35
  Bottom 0.813: T5.3 55.88,134.62 D6.A 54.61,133.35 50.17,133.35 | 50.17,133.35 48.9,133.35 | 48.9,133.35 47.63,133.35 | 47.63,133.35 K5.16 | 48.9,134.62 U$12.A | 48.9,133.35 48.9,134.62 | 50.17,133.35 48.9,134.62 | 48.9,134.62 47.63,133.35
N$16
  Bottom 0.813: T17.C 91.44,153.67 89.54,155.57 U$17.K K17.16 92.08,165.1 92.08,177.8 K17.S2
N$17
  Bottom 0.813: R2.1 57.79,173.99 T2.2
N$18
  Bottom 0.61: 54.61,179.07 55.88,180.34
  Bottom 0.813: T9.3 55.88,180.34 D1.A 54.61,179.07 50.17,179.07 | K1.16 47.63,179.07 | 47.63,179.07 48.9,179.07 | 48.9,179.07 50.17,179.07 | 48.9,180.34 U$16.A | 48.9,179.07 48.9,180.34 | 48.9,180.34 50.17,179.07 | 47.63,179.07 48.9,180.34
N$19
  Bottom 0.61: 54.61,167.64 55.88,168.91
  Bottom 0.813: T2.3 55.88,168.91 D9.A 54.61,167.64 50.17,167.64 | K2.16 47.63,167.64 | 47.63,167.64 48.9,167.64 | 48.9,167.64 50.17,167.64 | 48.9,168.91 U$15.A | 48.9,167.64 48.9,168.91 | 48.9,168.91 50.17,167.64 | 47.63,167.64 48.9,168.91
N$20
  Bottom 0.813: R6.1 57.79,128.27 T6.2
N$21
  Bottom 0.813: R3.1 57.79,162.56 T3.2
N$22
  Bottom 0.61: 54.61,156.21 55.88,157.48
  Bottom 0.813: T3.3 55.88,157.48 D8.A 54.61,156.21 50.17,156.21 | K3.16 47.63,156.21 | 47.63,156.21 48.9,156.21 | 48.9,156.21 50.17,156.21 | 48.9,157.48 U$14.A | 48.9,156.21 48.9,157.48 | 48.9,157.48 50.17,156.21 | 47.63,156.21 48.9,157.48
N$23
  Bottom 0.61: 55.88,123.19 54.61,121.92
  Bottom 0.813: 50.17,121.92 54.61,121.92 D5.A 55.88,123.19 T6.3 | 50.17,121.92 48.9,121.92 | 48.9,121.92 47.63,121.92 | 47.63,121.92 K6.16 | 48.9,123.19 U$11.A | 48.9,121.92 48.9,123.19 | 50.17,121.92 48.9,123.19 | 48.9,123.19 47.63,121.92
N$24
  Bottom 0.813: R4.1 57.79,151.13 T4.2
N$25
  Bottom 0.61: 54.61,144.78 55.88,146.05
  Bottom 0.813: T4.3 55.88,146.05 D7.A 54.61,144.78 50.17,144.78 | 47.63,144.78 K4.16 | 48.9,144.78 47.63,144.78 | 48.9,144.78 50.17,144.78 | 48.9,146.05 U$13.A | 48.9,146.05 48.9,144.78 | 48.9,146.05 50.17,144.78 | 48.9,146.05 47.63,144.78
N$26
  Bottom 0.813: R7.1 57.79,116.84 T7.2
N$27
  Bottom 0.61: 55.88,111.76 54.61,110.49
  Bottom 0.813: T7.3 55.88,111.76 D4.A 54.61,110.49 50.17,110.49 | 50.17,110.49 48.9,110.49 | 48.9,110.49 47.63,110.49 | 47.63,110.49 K7.16 | 48.9,111.76 U$10.A | 48.9,110.49 48.9,111.76 | 50.17,110.49 48.9,111.76 | 48.9,111.76 47.63,110.49
N$28
  Bottom 0.813: R8.1 57.79,105.41 T8.2
N$29
  Bottom 0.61: 55.88,100.33 54.61,99.06
  Bottom 0.813: T8.3 55.88,100.33 D3.A 54.61,99.06 50.17,99.06 | 50.17,99.06 48.9,99.06 | 48.9,99.06 47.63,99.06 | 47.63,99.06 K8.16 | 48.9,100.33 U$9.A | 48.9,99.06 48.9,100.33 | 50.17,99.06 48.9,100.33 | 48.9,100.33 47.63,99.06
N$30
  Bottom 0.813: IC3.12 75.57,144.15 R5.2
N$32
  Bottom 0.813: R34.1 V1.13
N$33
  Bottom 0.61: 98.43,66.04 98.43,30.48 97.16,29.21 IC1.1
  Bottom 0.813: JP1.1 JP1.3 JP1.5 JP1.7 JP1.9 JP1.11 JP1.13 JP1.15 95.25,70.48 98.43,67.31 98.43,66.04
N$34
  Bottom 0.61: IC7.14 87,63.5 IC3.1
N$35
  Bottom 0.813: X1.1 19.3,186.69 K1.S1
N$36
  Bottom 0.813: X1.2 16.71,179.07 K1.S2
N$37
  Bottom 0.813: X1.3 17.88,175.26 K2.S1
N$38
  Bottom 0.813: X1.4 15.29,167.64 K2.S2
N$39
  Bottom 0.813: X1.5 16.46,163.83 K3.S1
N$40
  Bottom 0.813: X1.6 13.87,156.21 K3.S2
N$41
  Bottom 0.813: X1.7 15.04,152.4 K4.S1
N$42
  Bottom 0.813: X1.8 12.95,144.78 K4.S2
N$43
  Bottom 0.813: X2.1 13.59,140.97 K5.S1
N$44
  Bottom 0.813: X2.2 14.4,133.35 K5.S2
N$45
  Bottom 0.813: X2.3 13.23,129.54 K6.S1
N$46
  Bottom 0.813: X2.4 15.82,121.92 K6.S2
N$47
  Bottom 0.813: X2.5 14.66,118.11 K7.S1
N$48
  Bottom 0.813: X2.6 17.25,110.49 K7.S2
N$49
  Bottom 0.813: X2.7 16.08,106.68 K8.S1
N$50
  Bottom 0.813: X2.8 18.67,99.06 K8.S2
N$51
  Bottom 0.813: U$16.K 48.9,185.42 50.17,186.69 R18.1
N$52
  Bottom 0.61: 55.88,88.9 54.61,87.63
  Bottom 0.813: 48.9,88.9 U$8.A | 48.9,88.9 48.9,87.63 | T1.3 55.88,88.9 D2.A 54.61,87.63 50.17,87.63 | 50.17,87.63 47.63,87.63 | 47.63,87.63 K9.16 | 50.17,87.63 48.9,88.9 | 47.63,87.63 48.9,88.9
N$53
  Bottom 0.406: 97.16,33.66 97.16,34.92
  Bottom 0.61: IC7.11 95.89,64.77 97.16,63.5 97.16,33.66 97.16,31.75 94.62,29.21 IC1.2
N$54
  Bottom 0.813: T10.2 57.79,82.55 R10.1
N$55
  Bottom 0.61: 55.88,77.47 54.61,76.2
  Bottom 0.813: 48.9,77.47 48.9,76.2 | T10.3 55.88,77.47 D10.A 54.61,76.2 50.17,76.2 | 50.17,76.2 47.63,76.2 | 47.63,76.2 K10.16 | 48.9,77.47 U$7.A | 50.17,76.2 48.9,77.47 | 47.63,76.2 48.9,77.47
N$56
  Bottom 0.813: T11.2 57.79,71.12 R11.1
N$57
  Bottom 0.61: 55.88,66.04 54.61,64.77
  Bottom 0.813: 48.9,66.04 U$6.A | 48.9,66.04 48.9,64.77 | T11.3 55.88,66.04 D16.A 54.61,64.77 50.17,64.77 | 50.17,64.77 47.63,64.77 | 47.63,64.77 K11.16 | 50.17,64.77 48.9,66.04 | 47.63,64.77 48.9,66.04
N$58
  Bottom 0.813: T12.2 57.79,59.69 R12.1
N$59
  Bottom 0.254: 127.57,104.57 130.97,102.3
N$60
  Bottom 0.61: 55.88,54.61 54.61,53.34
  Bottom 0.813: 48.9,54.61 48.9,53.34 | T12.3 55.88,54.61 D15.A 54.61,53.34 50.17,53.34 | 50.17,53.34 47.63,53.34 | 47.63,53.34 K12.16 | 50.17,53.34 48.9,54.61 | 48.9,54.61 U$5.A | 47.63,53.34 48.9,54.61
N$61
  Bottom 0.813: T13.2 57.79,48.26 R13.1
N$62
  Bottom 0.61: 55.88,43.18 54.61,41.91
  Bottom 0.813: T13.3 55.88,43.18 D14.A 54.61,41.91 50.17,41.91 | 50.17,41.91 48.9,41.91 | 48.9,41.91 47.63,41.91 | 47.63,41.91 K13.16 | 48.9,41.91 48.9,43.18 | 48.9,43.18 U$4.A | 50.17,41.91 48.9,43.18 | 48.9,43.18 47.63,41.91
N$63
  Bottom 0.813: T14.2 57.79,36.83 R14.1
N$64
  Bottom 0.61: 55.88,31.75 54.61,30.48
  Bottom 0.813: 50.17,30.48 54.61,30.48 D13.A 55.88,31.75 T14.3 | 50.17,30.48 48.9,30.48 | 48.9,30.48 47.63,30.48 | 47.63,30.48 K14.16 | 48.9,30.48 48.9,31.75 | 48.9,31.75 U$3.A | 50.17,30.48 48.9,31.75 | 48.9,31.75 47.63,30.48
N$65
  Bottom 0.813: R15.1 57.79,25.4 T15.2
N$66
  Bottom 0.61: 55.88,20.32 54.61,19.05
  Bottom 0.813: 48.9,20.32 U$2.A | 48.9,20.32 48.9,19.05 | T15.3 55.88,20.32 D12.A 54.61,19.05 50.17,19.05 | 50.17,19.05 47.63,19.05 | 47.63,19.05 K15.16 | 50.17,19.05 48.9,20.32 | 47.63,19.05 48.9,20.32
N$67
  Bottom 0.813: T16.2 57.79,13.97 R16.1
N$68
  Bottom 0.61: 55.88,8.89 54.61,7.62 | 50.17,7.62 48.9,8.89 47.63,7.62
  Bottom 0.813: U$1.A 48.9,8.89 48.9,7.62 | T16.3 55.88,8.89 D11.A 54.61,7.62 50.17,7.62 47.63,7.62 K16.16
N$69
  Bottom 0.406: IC2.7 85.73,57.78 85.09,58.42 85.09,91.44 81.92,94.61 R9.2
N$70
  Bottom 0.813: R10.2 74.93,82.55 79.38,78.1 IC2.9
N$71
  Bottom 0.813: R11.2 71.12,64.77 74.93,60.96 74.93,59.69 76.84,57.78 IC2.10
N$72
  Bottom 0.813: IC2.11 73.66,55.24 71.12,57.78 R12.2
N$73
  Bottom 0.813: IC2.15 78.11,45.08 75.57,42.55 75.57,18.42 R16.2
N$74
  Bottom 0.813: IC2.14 77.47,47.62 73.66,43.81 73.66,35.56 71.12,33.02 R15.2
N$75
  Bottom 0.813: IC2.13 76.84,50.16 71.12,44.45 R14.2
N$76
  Bottom 0.813: IC2.12 73.66,52.7 71.12,50.16 R13.2
N$77
  Bottom 0.61: IC3.2 87.63,136.53 89.54,134.62 89.54,62.87 92.71,59.69
  Bottom 0.813: 92.71,59.69 IC7.13 93.98,59.69
N$78
  Bottom 0.813: K9.S1 19.05,95.25 12.7,88.9 X3.1
N$79
  Bottom 0.813: K9.S2 19.69,87.63 15.88,83.82 12.7,83.82 X3.2
N$80
  Bottom 0.813: X3.3 16.41,78.64 16.51,78.74 16.51,80.01 20.32,83.82 K10.S1
N$81
  Bottom 0.813: K10.S2 19.69,76.2 17.15,73.66 12.7,73.66 X3.4
N$82
  Bottom 0.813: K11.S1 20.96,72.39 17.15,68.58 12.7,68.58 X3.5
N$83
  Bottom 0.813: X3.6 12.7,63.5 13.97,64.77 K11.S2
N$84
  Bottom 0.813: K12.S1 17.78,60.96 15.88,59.05 13.34,59.05 12.7,58.42 X3.7
N$85
  Bottom 0.813: X3.8 20.07,53.59 20.32,53.34 K12.S2
N$86
  Bottom 0.813: K13.S1 17.78,49.53 16.51,48.26 13.34,48.26 12.7,47.62 X4.1
N$87
  Bottom 0.813: K13.S2 17.15,41.91 15.88,43.18 12.7,43.18 X4.2
N$88
  Bottom 0.813: X4.3 12.7,38.1 K14.S1
N$89
  Bottom 0.813: K14.S2 20.32,30.48 17.78,33.02 12.7,33.02 X4.4
N$90
  Bottom 0.813: K15.S1 18.42,26.67 17.15,27.94 12.7,27.94 X4.5
N$91
  Bottom 0.813: K15.S2 20.32,19.05 16.51,22.86 12.7,22.86 X4.6
N$92
  Bottom 0.813: K16.S1 19.69,15.24 16.51,18.42 13.34,18.42 12.7,17.78 X4.7
N$93
  Bottom 0.813: X4.8 12.7,12.7 17.78,7.62 K16.S2
N$94
  Bottom 0.813: U$14.K 48.9,162.56 50.17,163.83 R20.1
N$95
  Bottom 0.813: U$15.K 48.9,173.99 50.17,175.26 R19.1
N$96
  Bottom 0.813: U$1.K 48.9,13.97 50.17,15.24 R32.1
N$97
  Bottom 0.61: IC3.3 89.54,139.06 90.81,137.8 90.81,64.13 92.71,62.23
  Bottom 0.813: 92.71,62.23 IC7.12
N$98
  Bottom 0.813: U$13.K 48.9,151.13 50.17,152.4 R17.1
N$109
  Bottom 0.813: 57.15,81.91 57.79,82.55 60.96,82.55
N$111
  Bottom 0.813: 57.15,70.48 57.79,71.12 60.96,71.12
N$112
  Bottom 0.813: U$17.A R33.1
N$113
  Bottom 0.813: 57.15,59.05 57.79,59.69 60.96,59.69
N$114
  Bottom 0.813: IC2.3 89.54,47.62 91.44,49.53 IC7.17
N$115
  Bottom 0.813: 57.15,47.62 57.79,48.26 60.96,48.26
N$117
  Bottom 0.813: 57.15,36.19 57.79,36.83 60.96,36.83
N$118
  Bottom 0.813: IC2.1 89.54,42.55 91.44,44.45 IC7.19
N$121
  Bottom 0.813: 57.15,13.33 57.79,13.97 60.96,13.97
N$128
  Bottom 0.254: 131.37,102.75 127.92,105.05
N$130
  Bottom 0.254: 127.92,106.57 131.4,108.84
N$133
  Bottom 0.813: 12.7,78.74 12.7,78.64
N$138
  Bottom 0.61: 131.35,103.16 128.25,105.17 128.46,105.77 131.61,103.56 132.06,104.67 132.29,106.36 132.01,107.5 131.35,108.49 128.33,106.41 128.36,106.04 131.59,104.23 131.91,106.43 131.13,108 128.53,106.14 131.61,104.95 130.93,107.62 129.19,106.25 131.39,105.55 130.72,107.13 129.93,106.31 130.87,106.24 131.95,106.4
N$147
  Bottom 0.61: 130.49,102.22 128.76,101.39 127.42,101.35 126.14,101.65 125.28,102.08 124.44,102.94 123.68,103.97 123.34,105.21 124.55,105.06 125.38,104.03 126.54,103.83 127.04,103.94 127.59,104.2 130.11,102.48 129.34,102.03 129.31,102.36 127.28,103.76 126.83,103.53 129.11,101.84 126.11,101.85 123.89,103.99 124.03,104.94 124.79,104.26 124.23,104.09 125.15,103.69 125.29,102.98 125.77,103.66 125.72,102.55 126.41,103.6 126.09,102.15 126.81,103.25 126.68,102.03 127.2,102.83 127.44,102.16 128.06,102.35
N$148
  Bottom 0.61: 30.48,15.88 31.12,15.24 | 30.48,27.94 31.75,26.67 30.48,25.4 | 30.48,36.83 31.75,38.1 30.48,39.37 | 30.48,48.26 31.75,49.53 30.48,50.8 | 30.48,62.23 31.75,60.96 30.48,59.69 | 30.48,71.12 31.75,72.39 30.48,73.66 | 30.48,107.31 31.12,106.68 | 30.48,119.38 31.75,118.11 30.48,116.84 | 30.48,128.27 31.75,129.54 30.48,130.81 | 30.48,139.7 31.75,140.97 30.48,142.24 | 30.48,153.67 31.75,152.4 30.48,151.13 | 30.48,162.56 31.75,163.83 30.48,165.1
  Bottom 0.813: 30.48,60.96 30.48,62.23 30.48,71.12 30.48,72.39 | 30.48,49.53 30.48,50.8 30.48,59.69 30.48,60.96 | 30.48,49.53 30.48,48.26 30.48,39.37 30.48,38.1 | 30.48,38.1 30.48,36.83 30.48,27.94 30.48,26.67 | 30.48,26.67 30.48,25.4 30.48,15.88 30.48,15.24 31.12,15.24 K16.P1 | 30.48,72.39 30.48,73.66 30.48,82.55 | 30.48,83.82 30.48,82.55 | 30.48,95.25 30.48,93.98 | 30.48,93.98 30.48,85.09 | 30.48,85.09 30.48,83.82 | 30.48,83.82 31.75,83.82 | 31.75,83.82 K10.P1 | 30.48,72.39 31.75,72.39 K11.P1 | 30.48,38.1 31.75,38.1 K14.P1 | 30.48,26.67 31.75,26.67 K15.P1 | K13.P1 31.75,49.53 30.48,49.53 | 30.48,60.96 31.75,60.96 K12.P1 | 31.75,83.82 30.48,82.55 | 30.48,85.09 31.75,83.82 | 31.75,95.25 30.48,93.98 | 30.48,152.4 30.48,153.67 30.48,162.56 30.48,163.83 | 30.48,140.97 30.48,142.24 30.48,151.13 30.48,152.4 | 30.48,140.97 30.48,139.7 30.48,130.81 30.48,129.54 | 30.48,129.54 30.48,128.27 30.48,119.38 30.48,118.11 | 30.48,118.11 30.48,116.84 30.48,107.95 | 30.48,107.95 30.48,107.31 30.48,106.68 | 30.48,163.83 30.48,165.1 30.48,175.26 | 30.48,175.26 30.48,186.69 | 30.48,106.68 31.12,106.68 31.75,106.68 | 31.75,106.68 K8.P1 | 30.48,175.26 K2.P1 | 30.48,163.83 31.75,163.83 K3.P1 | 30.48,129.54 31.75,129.54 K6.P1 | 30.48,118.11 31.75,118.11 K7.P1 | K5.P1 31.75,140.97 30.48,140.97 | 30.48,152.4 31.75,152.4 K4.P1 | 30.48,105.41 30.48,106.68 | 30.48,105.41 30.48,96.52 | 30.48,96.52 30.48,95.25 | 30.48,95.25 30.48,93.34 | 30.48,95.25 31.75,95.25 | 31.75,95.25 K9.P1 | 30.48,96.52 31.75,95.25 | 31.75,106.68 30.48,105.41 | 30.48,107.95 31.75,106.68 | 30.48,186.69 K1.P1 | 30.48,186.69 30.48,189.87 34.93,194.31 101.6,194.31 116.84,179.07 X5.2
N$150
  Bottom 0.813: U$12.K 48.9,139.7 50.17,140.97 R21.1
N$153
  Bottom 0.813: U$11.K 48.9,128.27 50.17,129.54 R22.1
N$156
  Bottom 0.813: U$10.K 48.9,116.84 50.17,118.11 R23.1
N$160
  Bottom 0.813: U$9.K 48.9,105.41 50.17,106.68 R24.1
N$163
  Bottom 0.813: U$8.K 48.9,93.98 50.17,95.25 R25.1
N$165
  Bottom 0.813: U$7.K 48.9,82.55 50.17,83.82 R26.1
N$169
  Bottom 0.813: U$6.K 48.9,71.12 50.17,72.39 R27.1
N$171
  Bottom 0.813: U$5.K 48.9,59.69 50.17,60.96 R28.1
N$174
  Bottom 0.813: U$4.K 48.9,48.26 50.17,49.53 R29.1
N$177
  Bottom 0.813: U$3.K 48.9,36.83 50.17,38.1 R30.1
N$180
  Bottom 0.813: U$2.K 48.9,25.4 50.17,26.67 R31.1
N$14823
  Bottom 0.61: 35.56,8.89 34.29,7.62 | 35.56,19.69 34.93,19.05 35.56,18.42 | 35.56,29.21 34.29,30.48 35.56,31.75 | 35.56,43.18 34.29,41.91 35.56,40.64 | 35.56,52.07 34.29,53.34 35.56,54.61 | 35.56,63.5 34.29,64.77 35.56,66.04 | 34.29,87.63 35.56,86.36
  Bottom 0.813: 35.56,30.48 34.29,30.48 K14.P2 | 35.56,30.48 35.56,29.21 35.56,19.69 35.56,19.05 | 35.56,19.05 34.93,19.05 K15.P2 | 35.56,19.05 35.56,18.42 35.56,8.89 35.56,7.62 34.29,7.62 K16.P2 | 35.56,41.91 34.29,41.91 K13.P2 | 35.56,41.91 35.56,40.64 35.56,31.75 35.56,30.48 | K12.P2 34.29,53.34 35.56,53.34 | 35.56,53.34 35.56,52.07 35.56,43.18 35.56,41.91 | 35.56,64.77 34.29,64.77 K11.P2 | 35.56,53.34 35.56,54.61 35.56,63.5 35.56,64.77 | 35.56,76.2 K10.P2 | 35.56,64.77 35.56,66.04 35.56,76.2 | 35.56,76.2 35.56,86.36 35.56,87.63 | 35.56,87.63 34.29,87.63 | 34.29,87.63 K9.P2 | 35.56,88.9 35.56,87.63 | 35.56,99.06 34.29,99.06 | 34.29,99.06 K8.P2 | 35.56,156.21 35.56,163.83 | 35.56,156.21 35.56,144.78 | 35.56,144.78 35.56,133.35 | 35.56,133.35 35.56,121.92 | 35.56,121.92 35.56,110.49 | 35.56,110.49 35.56,100.33 | 35.56,100.33 35.56,99.06 | 35.56,163.83 35.56,165.1 | 35.56,88.9 34.29,87.63 | 35.56,99.06 35.56,97.79 | 35.56,97.79 35.56,88.9 | 34.29,99.06 35.56,97.79 | 35.56,100.33 34.29,99.06 | 35.56,110.49 K7.P2 | 35.56,121.92 K6.P2 | 35.56,133.35 K5.P2 | 35.56,144.78 K4.P2 | 35.56,156.21 K3.P2 | 35.56,163.83 35.56,167 | 35.56,167 35.56,179.07 | K2.P2 34.93,167.64 35.56,167 | 35.56,179.07 K1.P2 | 35.56,179.07 35.56,188.59 38.74,191.77 95.25,191.77 115.55,171.47 X5.1
PB0
  Bottom 0.813: BUS.2 IC7.2
PB1
  Bottom 0.813: BUS.4 IC7.3
PB2
  Bottom 0.813: BUS.6 IC7.4
PB3
  Bottom 0.813: BUS.8 IC7.5
PB4
  Bottom 0.813: BUS.10 IC7.6
PB5
  Bottom 0.813: BUS.12 IC7.7
PB6
  Bottom 0.813: BUS.14 IC7.8
PB7
  Bottom 0.813: IC7.9 102.87,62.23 103.51,61.59 113.03,61.59 BUS.16
PE
  Bottom 0.406: 108.59,137.8 112.4,137.8 | 95.25,55.88 91.44,55.88
  Bottom 0.61: 38.1,16.51 39.37,15.24 38.1,13.97 | 38.1,25.4 39.37,26.67 38.1,27.94 | 38.1,36.83 39.37,38.1 38.1,39.37 | 38.1,48.26 39.37,49.53 38.1,50.8 | 38.1,59.69 39.37,60.96 38.1,62.23 | 38.1,71.12 39.37,72.39 38.1,73.66 | 38.1,82.55 39.37,83.82 38.1,85.09 | 39.37,95.25 38.1,93.98 | 114.94,63.5 112.4,63.5 | IC1.7 91.44,36.19 95.89,40.64 95.89,55.24 95.25,55.88 | IC2.8 88.27,60.33 88.9,59.69 88.9,57.78 89.54,57.15 90.17,57.15 91.44,55.88 | 107.95,137.8 112.4,137.8
  Bottom 0.813: 39.37,95.25 38.1,95.25 38.1,93.98 38.1,85.09 38.1,83.82 | 39.37,95.25 K9.1 R25.2 | 38.1,83.82 39.37,83.82 K10.1 R26.2 | 38.1,72.39 39.37,72.39 K11.1 R27.2 | 38.1,72.39 38.1,73.66 38.1,82.55 38.1,83.82 | 38.1,60.96 39.37,60.96 K12.1 R28.2 | 38.1,60.96 38.1,62.23 38.1,71.12 38.1,72.39 | 38.1,49.53 39.37,49.53 K13.1 R29.2 | 38.1,49.53 38.1,50.8 38.1,59.69 38.1,60.96 | 38.1,38.1 39.37,38.1 K14.1 R30.2 | 38.1,49.53 38.1,48.26 38.1,39.37 38.1,38.1 | 38.1,26.67 39.37,26.67 K15.1 R31.2 | 38.1,38.1 38.1,36.83 38.1,27.94 38.1,26.67 | 38.1,15.24 39.37,15.24 K16.1 R32.2 | 38.1,26.67 38.1,25.4 38.1,16.51 38.1,15.24 | 38.1,15.24 38.1,13.97 38.1,5.72 39.37,4.44 87,4.44 109.86,27.31 | 116.21,58.42 BUS.11 117.48,57.15 | 116.21,58.42 BUS.13 BUS.15 114.94,63.5 | 119.38,57.15 117.48,57.15 | 117.48,57.15 116.21,58.42 | 39.37,186.69 38.1,186.69 38.1,185.42 | 39.37,186.69 K1.1 R18.2 | 38.1,175.26 38.1,176.53 | 38.1,176.53 38.1,185.42 | 38.1,163.83 38.1,165.1 | 38.1,165.1 38.1,173.99 | 38.1,173.99 38.1,175.26 | 38.1,152.4 38.1,153.67 | 38.1,153.67 38.1,162.56 | 38.1,162.56 38.1,163.83 | 38.1,142.24 38.1,140.97 | 38.1,151.13 38.1,142.24 | 38.1,152.4 38.1,151.13 | 38.1,140.97 38.1,139.7 | 38.1,139.7 38.1,130.81 | 38.1,130.81 38.1,129.54 | 38.1,129.54 38.1,128.27 | 38.1,128.27 38.1,119.38 | 38.1,119.38 38.1,118.11 | 38.1,118.11 38.1,116.84 | 38.1,116.84 38.1,107.95 | 38.1,107.95 38.1,106.68 | 38.1,175.26 39.37,175.26 | 39.37,175.26 K2.1 R19.2 | 38.1,163.83 39.37,163.83 | 39.37,163.83 K3.1 R20.2 | 39.37,152.4 38.1,152.4 | 39.37,152.4 K4.1 R17.2 | 38.1,140.97 39.37,140.97 | 39.37,140.97 K5.1 R21.2 | 38.1,129.54 39.37,129.54 | 39.37,129.54 K6.1 R22.2 | 38.1,118.11 39.37,118.11
  Bottom 0.813: 39.37,118.11 K7.1 R23.2 | 38.1,106.68 39.37,106.68 | 39.37,106.68 K8.1 R24.2 | 38.1,106.68 38.1,105.41 | 38.1,105.41 38.1,96.52 | 38.1,96.52 38.1,94.61 | 38.1,96.52 39.37,95.25 | 39.37,118.11 38.1,116.84 | 38.1,119.38 39.37,118.11 | 39.37,106.68 38.1,105.41 | 38.1,107.95 39.37,106.68 | 39.37,129.54 38.1,128.27 | 38.1,130.81 39.37,129.54 | 39.37,140.97 38.1,139.7 | 38.1,142.24 39.37,140.97 | 39.37,152.4 38.1,151.13 | 39.37,152.4 38.1,153.67 | 38.1,162.56 39.37,163.83 | 39.37,163.83 38.1,165.1 | 38.1,173.99 39.37,175.26 | 39.37,175.26 38.1,176.53 | 38.1,185.42 39.37,186.69 | 121.28,55.24 119.38,57.15 | 121.28,55.24 121.28,39.37 113.03,30.48 111.12,28.58 | 109.86,27.31 110.49,27.94 | 110.49,27.94 111.12,28.58 | 109.86,28.58 107.95,30.48 IC8.2 107.95,37.47 103.51,41.91 IC7.1 100.97,26.67 96.52,22.22 83.19,22.22 81.92,23.5 IC1.7 | 110.49,27.94 109.86,28.58 | 109.86,28.58 111.12,28.58 | 109.86,27.31 109.86,28.58 | V1.7 116.21,153.67 115.57,153.67 | 100.97,153.67 99.7,153.67 | 114.3,153.67 115.57,153.67 | 114.3,153.67 113.03,153.67 | 113.03,153.67 100.97,153.67 | 99.7,152.4 99.7,147.32 98.43,146.05 94.62,146.05 88.9,151.76 IC3.8 87,168.91 88.27,170.18 K17.P2 | 99.7,153.67 99.7,152.4 | 99.7,153.67 T17.E 99.7,152.4 | 100.97,153.67 99.7,152.4 | 121.28,55.24 121.28,59.05 | 121.28,59.05 121.28,90.81 115.57,96.52 109.22,96.52 106.68,99.06 106.68,136.53 107.95,137.8 108.59,137.8 | 119.38,57.15 120.65,57.15 120.65,56.52 120.02,56.52 119.38,57.15 | 119.38,57.15 121.28,59.05 | 121.28,59.05 121.28,58.42 120.65,57.78 | 112.4,137.8 113.03,137.8 114.3,139.06 114.3,152.4 | 114.3,152.4 114.3,153.67 | 114.3,152.4 115.57,153.67 | 114.3,152.4 113.03,153.67
  Bottom 0.813: 112.4,63.5 103.51,63.5 102.24,64.77 IC7.10
(copper drawn outside any net)
  Bottom 0.254: 124.75,105.44 arc125 127.65,104.67 | 127.84,106.67 arc-58 127.9,105.02 | 123.05,105.47 arc128 131,102.3 | 131.37,108.94 arc-82 131.37,102.72
  shapes: Bottom circle x10

### Text on the board
Bottom: LMPT